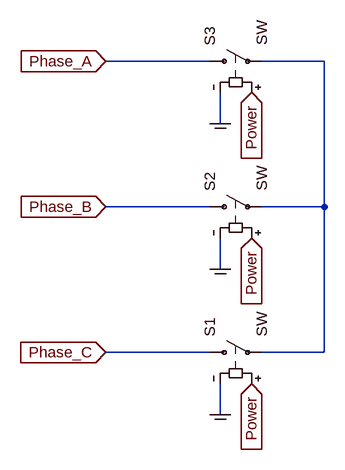
[diagram p0: schematic killswitch.asc]
killswitch.asc, the LTspice schematic file:
Version 4
SHEET 1 880 680
WIRE 352 -64 192 -64
WIRE 528 -64 432 -64
WIRE 368 32 368 -16
WIRE 352 160 192 160
WIRE 528 160 528 -64
WIRE 528 160 432 160
WIRE 368 256 368 208
WIRE 352 384 192 384
WIRE 528 384 528 160
WIRE 528 384 432 384
WIRE 368 480 368 432
FLAG 368 32 COM
FLAG 368 256 COM
FLAG 368 480 COM
FLAG 192 -64 Phase_A
IOPIN 192 -64 In
FLAG 192 160 Phase_B
IOPIN 192 160 In
FLAG 192 384 Phase_C
IOPIN 192 384 In
FLAG 416 -16 Power
IOPIN 416 -16 In
FLAG 416 208 Power
IOPIN 416 208 In
FLAG 416 432 Power
IOPIN 416 432 In
SYMBOL sw 336 384 R270
SYMATTR InstName S1
SYMBOL sw 336 160 R270
SYMATTR InstName S2
SYMBOL sw 336 -64 R270
SYMATTR InstName S3

The netlist it stands for:
* killswitch.asc
S1 Phase_C N001 Power COM SW
S2 Phase_B N001 Power COM SW
S3 Phase_A N001 Power COM SW
.backanno
.end